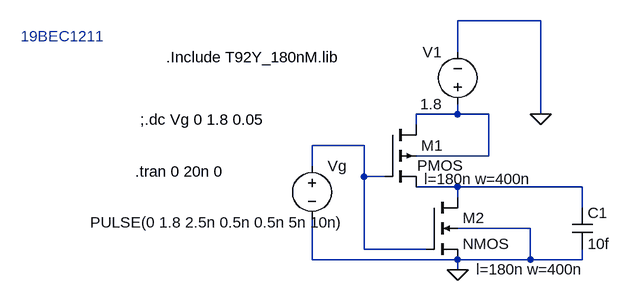
[diagram p0: schematic CMOS_Inverter.asc]
CMOS_Inverter.asc, the LTspice schematic file:
Version 4
SHEET 1 880 680
WIRE 368 -32 240 -32
WIRE 240 16 240 -32
WIRE 240 112 240 96
WIRE 240 112 176 112
WIRE 288 112 240 112
WIRE 368 112 368 -32
WIRE 176 128 176 112
WIRE 96 160 16 160
WIRE 288 176 288 112
WIRE 288 176 176 176
WIRE 16 192 16 160
WIRE 96 208 96 160
WIRE 128 208 96 208
WIRE 240 224 176 224
WIRE 432 224 240 224
WIRE 240 240 240 224
WIRE 432 256 432 224
WIRE 352 288 240 288
WIRE 96 320 96 208
WIRE 192 320 96 320
WIRE 16 336 16 272
WIRE 240 336 16 336
WIRE 352 336 352 288
WIRE 352 336 240 336
WIRE 432 336 432 320
WIRE 432 336 352 336
WIRE 240 352 240 336
FLAG 240 352 0
FLAG 368 112 0
SYMBOL voltage 240 112 R180
WINDOW 0 24 96 Left 2
WINDOW 3 24 16 Left 2
WINDOW 123 0 0 Left 0
WINDOW 39 0 0 Left 0
SYMATTR InstName V1
SYMATTR Value 1.8
SYMBOL voltage 16 176 R0
WINDOW 3 -341 103 Left 2
WINDOW 123 0 0 Left 0
WINDOW 39 0 0 Left 0
SYMATTR Value PULSE(0 1.8 2.5n 0.5n 0.5n 5n 10n)
SYMATTR InstName Vg
SYMBOL nmos4 192 240 R0
WINDOW 123 77 111 Left 2
SYMATTR InstName M2
SYMATTR Value2 l=180n w=400n
SYMBOL pmos4 128 128 R0
WINDOW 3 50 63 Left 2
WINDOW 123 61 84 Left 2
SYMATTR InstName M1
SYMATTR Value2 l=180n w=400n
SYMBOL cap 416 256 R0
SYMATTR InstName C1
SYMATTR Value 10f
TEXT -208 24 Left 2 !.Include T92Y_180nM.lib
TEXT -256 200 Left 2 !.tran 0 20n 0
TEXT -432 -8 Left 2 ;19BEC1211
TEXT -248 120 Left 2 !;.dc Vg 0 1.8 0.05

The netlist it stands for:
* CMOS_Inverter.asc
V1 N001 0 1.8
Vg N002 0 PULSE(0 1.8 2.5n 0.5n 0.5n 5n 10n)
M2 N003 N002 0 0 NMOS l=180n w=400n
M1 N001 N002 N003 N001 PMOS l=180n w=400n
C1 N003 0 10f
.model NMOS NMOS
.model PMOS PMOS
.lib standard.mos
.Include T92Y_180nM.lib
.tran 0 20n 0
* 19BEC1211
;.dc Vg 0 1.8 0.05
.backanno
.end